# EAGLE design PCB_Punto_de_CobroV2 (EAGLE 8.7.0)
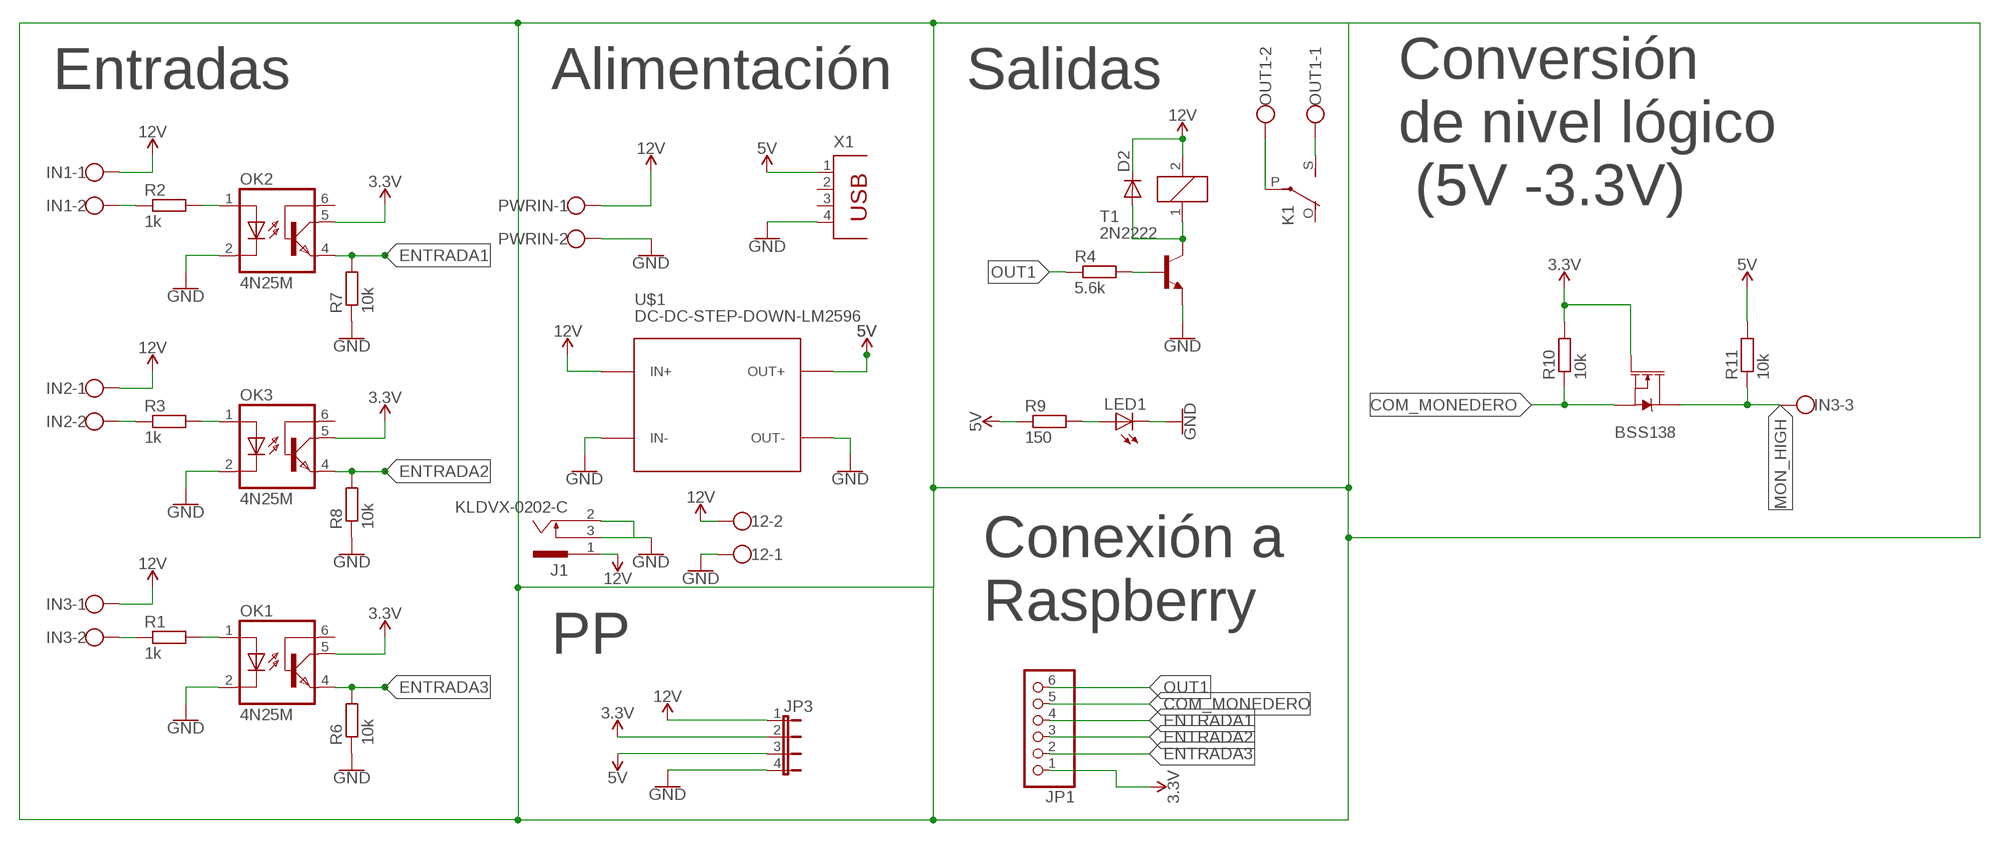
[diagram p0: schematic, sheet 1]

## Parts
12  W237-102  [W237-102]
D2  1N4148DO35-7  [DO35-7]
IN1  W237-102  [W237-102]
IN2  W237-102  [W237-102]
IN3  W237-103  [W237-103]
J1  KLDVX-0202-C  [KLDVX-0202-C]
JP1  PINHD-1X6  [1X06]
JP3  JP4E  [JP4]
K1  G5L  [G5LE]
LED1  LED5MM  [LED5MM]
OK1  4N25M  [DIL06]
OK2  4N25M  [DIL06]
OK3  4N25M  [DIL06]
OUT1  W237-102  [W237-102]
PWRIN  W237-102  [W237-102]
Q3  BSS138  MOSFET-NCH-BSS138  [SOT23-3]
R1  1k  R0204/7  [0204/7]
R2  1k  R0204/7  [0204/7]
R3  1k  R0204/7  [0204/7]
R4  5.6k  R0204/7  [0204/7]
R6  10k  R0204/7  [0204/7]
R7  10k  R0204/7  [0204/7]
R8  10k  R0204/7  [0204/7]
R9  150  R0204/7  [0204/7]
R10  10k  R0204/7  [0204/7]
R11  10k  R0204/7  [0204/7]
T1  2N2222  [TO18]
U$1  DC-DC-STEP-DOWN-LM2596  [DC-DC-STEP-DOWN-LM2596]
X1  PN87520  [PN87520]

## Nets
3.3V: JP1.1 JP3.2 OK1.5(COL) OK2.5(COL) OK3.5(COL) Q3.1(G) R10.2
5V: JP3.3 R9.1 R11.2 U$1.OUT+ X1.1
12V: 12.2 D2.C IN1.1 IN2.1 IN3.1 J1.1 JP3.1 K1.2 PWRIN.1 U$1.IN+
COM_MONEDERO: JP1.5 Q3.2(S) R10.1
ENTRADA1: JP1.4 OK2.4(EMI) R7.2
ENTRADA2: JP1.3 OK3.4(EMI) R8.2
ENTRADA3: JP1.2 OK1.4(EMI) R6.2
GND: 12.1 J1.2 J1.3 JP3.4 LED1.K(C) OK1.2(C) OK2.2(C) OK3.2(C) PWRIN.2 R6.1 R7.1 R8.1 T1.1(E) U$1.IN- U$1.OUT- X1.4
MON_HIGH: IN3.3 Q3.3(D) R11.1
N$1: OK1.1(A) R1.2
N$2: IN2.2 R3.1
N$3: OK2.1(A) R2.2
N$4: IN1.2 R2.1
N$5: OK3.1(A) R3.2
N$6: IN3.2 R1.1
N$9: R4.2 T1.2(B)
N$10: D2.A K1.1 T1.3(C)
N$11: LED1.A R9.2
N$12: K1.P(2:P) OUT1.2
N$13: K1.S(2:S) OUT1.1
OUT1: JP1.6 R4.1
Unconnected: J1.1@1 J1.2@1 J1.3@1 K1.O(2:O) OK1.6(BAS) OK2.6(BAS) OK3.6(BAS) X1.2 X1.3

## Notes on the sheet
- Entradas | Alimentación | Salidas
- Conversión 
  de nivel lógico
   (5V -3.3V)
- Conexión a 
  Raspberry
- PP

## Library data of the parts
12 IN1 IN2 OUT1 PWRIN = con-wago-500:W237-102: WAGO SCREW CLAMP; MPN: 237-102; OC_FARNELL: unknown; OC_NEWARK: 70K9898
D2 = diode:1N4148: DIODE high speed (Philips)
IN3 = con-wago-500:W237-103: WAGO SCREW CLAMP; MPN: 237-103; OC_FARNELL: unknown; OC_NEWARK: 18M7116
J1 = con-kycon:KLDVX-0202-: Power Jack, Vertical, PCB Mount, 2.0 mm, 2.5 mm, 3.0 mm Center Pin Source: KLDVX-0202x.pdf; OC_FARNELL: unknown; OC_NEWARK: unknown
JP1 = pinhead:PINHD-1X6: PIN HEADER
JP3 = jumper:JP4E: JUMPER
K1 = relay:G5L: RELAY 1 x switch, 10 A/120 V AC, 8 A/30 V ADC, Omron; OC_FARNELL: unknown; OC_NEWARK: unknown
LED1 = led:LED: LED OSRAM: - CHIPLED LG R971, LG N971, LY N971, LG Q971, LY Q971, LO R971, LY R971 LH N974, LH R974 LS Q976, LO Q976, LY Q976 LO Q996 - Hyper CHIPLED LW Q18S LB Q993, LB Q99A, LB R99A - SideLED LS A670, LO A670, LY A670, LG A670, LP A670 LB A673, LV A673, LT A673, LW A673 LH A674 LY A675 LS A676, LA A676, LO A676, LY A676, LW A676 LS A679, LY A679, LG A679 - Hyper Micro SIDELED® LS Y876, LA Y876, LO Y876, LY Y876 LT Y87S - SmartLED LW L88C, LW L88S LB L89C, LB L89S, LG L890 LS L89K, LO L89K, LY L89K LS L896, LA L896, LO L896, LY L896 - TOPLED LS T670, LO T670, LY T670, LG T670, LP T670 LSG T670, LSP T670, LSY T670, LOP T670, LYG T670 LG T671, LOG T671, LSG T671 LB T673, LV T673, LT T673, LW T673 LH T674 LS T676, LA T676, LO T676, LY T676, LB T676, LH T676, LSB T676, LW T676 LB T67C, LV T67C, LT T67C, LS T67K, LO T67K, LY T67K, LW E67C LS E67B, LA E67B, LO E67B, LY E67B, LB E67C, LV E67C, LT E67C LW T67C LS T679, LY T679, LG T679 LS T770, LO T770, LY T770, LG T770, LP T770 LB T773, LV T773, LT T773, LW T773 LH T774 LS E675, LA E675, LY E675, LS T675 LS T776, LA T776, LO T776, LY T776, LB T776 LHGB T686 LT T68C, LB T68C - Hyper Mini TOPLED® LB M676 - Mini TOPLED Santana® LG M470 LS M47K, LO M47K, LY M47K Source: http://www.osram.convergy.de LUXEON: - LUMILED® LXK2-PW12-R00, LXK2-PW12-S00, LXK2-PW14-U00, LXK2-PW14-V00 LXK2-PM12-R00, LXK2-PM12-S00, LXK2-PM14-U00 LXK2-PE12-Q00, LXK2-PE12-R00, LXK2-PE12-S00, LXK2-PE14-T00, LXK2-PE14-U00 LXK2-PB12-K00, LXK2-PB12-L00, LXK2-PB12-M00, LXK2-PB14-N00, LXK2-PB14-P00, LXK2-PB14-Q00 LXK2-PR12-L00, LXK2-PR12-M00, LXK2-PR14-Q00, LXK2-PR14-R00 LXK2-PD12-Q00, LXK2-PD12-R00, LXK2-PD12-S00 LXK2-PH12-R00, LXK2-PH12-S00 LXK2-PL12-P00, LXK2-PL12-Q00, LXK2-PL12-R00 Source: www.luxeon.com KINGBRIGHT: KA-3528ASYC Source: www.kingbright.com
OK1-OK3 = optocoupler:4N*?M: General Purpose 6-Pin Phototransistor Optocouplers Source: http://www.fairchildsemi.com/ds/4N/4N35-M.pdf; MPN: 4N25-M; OC_FARNELL: 1021349; OC_NEWARK: 98K9084
Q3 = SparkFun-DiscreteSemi:MOSFET-NCH: N-channel MOSFETs Voltage controlled devices that allow control of high current outputs. SparkFun Products: SparkFun OpenScale <https://www.sparkfun.com/products/13261> SparkFun Digital Sandbox <https://www.sparkfun.com/products/12651> SparkFun Monster Moto Shield <https://www.sparkfun.com/products/10182> SparkFun MOSFET Power Controller <https://www.sparkfun.com/products/11214>; PROD_ID: TRANS-00830; VALUE: 220mA/50V/3.5Ω
R1-R4 R6-R11 = eagle-ltspice:R: RESISTOR, European symbol; SPICEMODEL: NONE; SPICEPREFIX: R
T1 = transistor:2N2222: NPN TRANSISTOR
U$1 = diy-modules:DC-DC-STEP-DOWN-LM2596: DC/DC Step-Down Regulator based on LM2596-ADJ chip LM2596 datasheet available here: http://www.ti.com/lit/ds/symlink/lm2596.pdf Click here to find device on ebay.com <http://www.ebay.com/sch/lm2596+power+regulator>
X1 = con-berg:PN87520: BERG USB connector; OC_FARNELL: unknown; OC_NEWARK: unknown

## Board
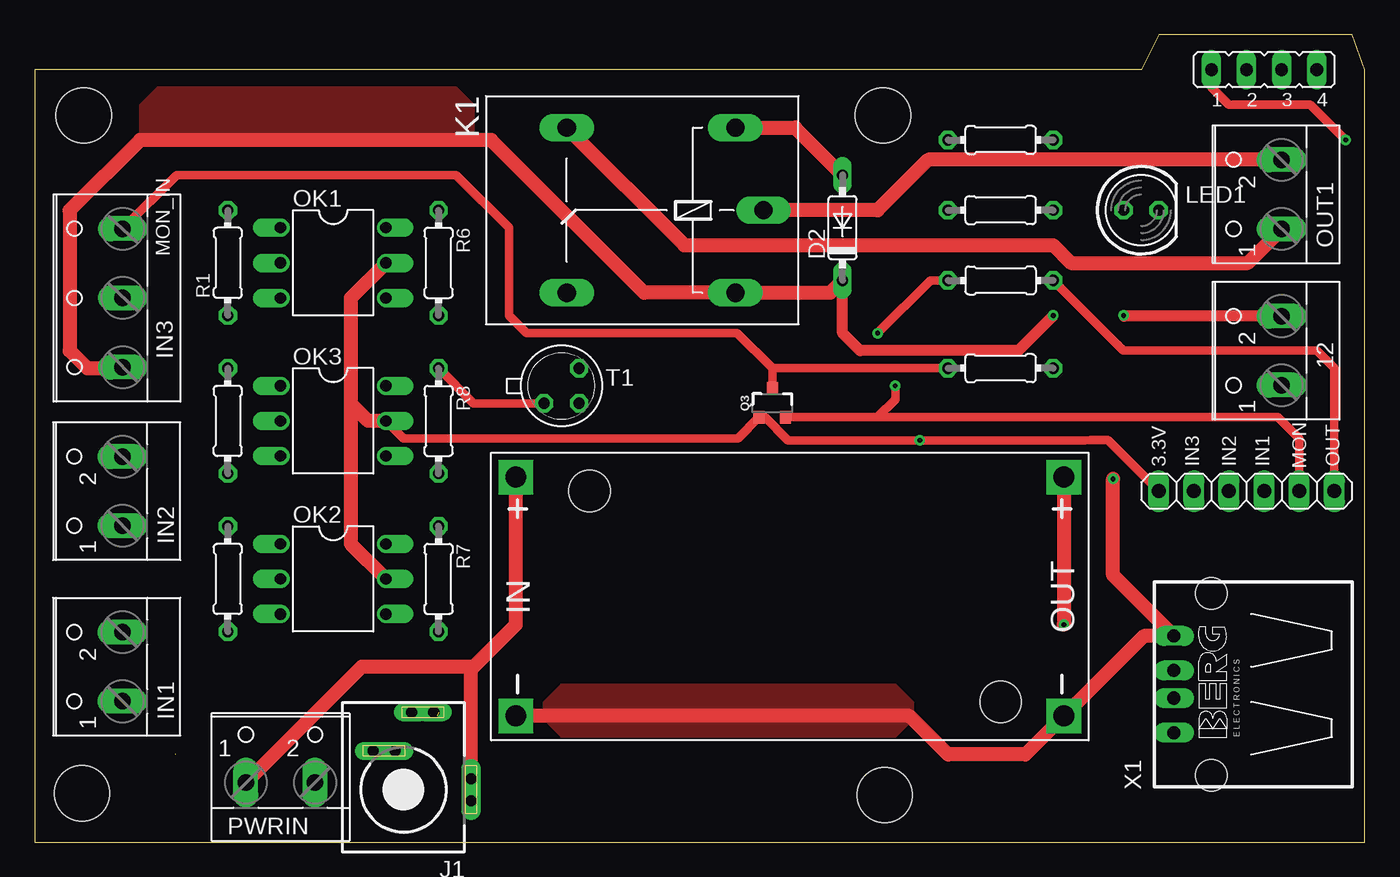
[diagram p1: board, top side]
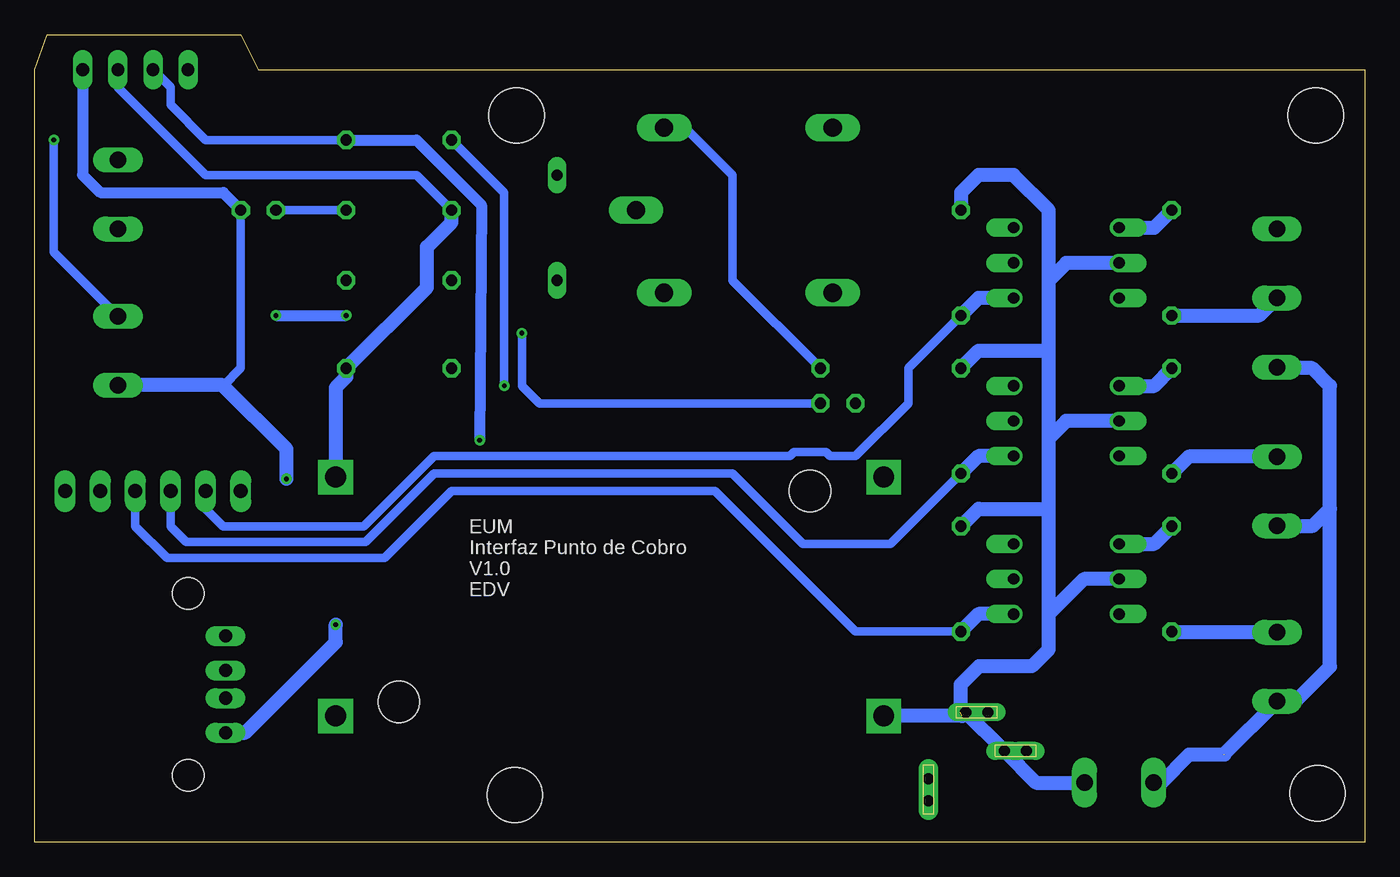
[diagram p2: board, bottom side, seen from below]

Size 96.19 x 58.42 mm. Coordinates in mm from the lower left corner, seen from the top.
Outline: 0,0 96.19,0 96.19,55.87 95.26,58.41 81.28,58.42 80.01,55.88 0,55.87 0,0
Copper layers (1*16): Top 0.035mm / dielectric 1.5mm / Bottom 0.035mm
Design rules "default": minimum track width 6mil, minimum drill 0.35mm, track to track 6mil, track to pad 6mil, pad to pad 6mil, via to via 6mil, smd to smd 6mil, copper to edge 40mil, drill to drill 6mil, minimum pad ring 10mil, minimum via ring 8mil, stop-mask expansion 4mil, vias tented up to drill 0mil, thermal gap 10mil
Holes 4 mm at 3.43,3.56 3.56,52.58 61.34,52.58 61.47,3.43

### Footprints (pad centres in the part's own frame; a part is rotated, then mirrored left to right if it is on the bottom)
W237-102 = drill 1.194 long: 1 -2.5,-1.27; 2 2.5,-1.27
DO35-7 = drill 0.813 long: A 3.81,0; C -3.81,0
W237-103 = drill 1.194 long: 1 -5,-1.29; 2 0,-1.29; 3 5,-1.29
KLDVX-0202-C = drill 0.8 pad 1.4 long: 1 -4.9,0.8; 1@1 -4.9,-0.8 | drill 0.8 pad 1.3 long: 2 -2.2,-5.6; 2@1 -0.6,-5.6; 3 0.6,-2.8; 3@1 2.2,-2.8
1X06 = drill 1.016 long: 1 -6.35,0; 2 -3.81,0; 3 -1.27,0; 4 1.27,0; 5 3.81,0; 6 6.35,0
JP4 = drill 0.914 long: 1 -3.81,0; 2 -1.27,0; 3 1.27,0; 4 3.81,0
G5LE = drill 1.321 long: 1 -7.493,-5.969; 2 -7.493,5.969; O 4.699,5.969; P -9.525,0; S 4.699,-5.969
LED5MM = drill 0.813 octagon: A -1.27,0; K 1.27,0
DIL06 = drill 0.813 offset: 1 -2.54,-3.81; 2 0,-3.81; 3 2.54,-3.81; 4 2.54,3.81; 5 0,3.81; 6 -2.54,3.81
SOT23-3 = smd 0.8 x 0.9: 1 -0.95,-1; 2 0.95,-1; 3 0,1.1
0204/7 = drill 0.813 octagon: 1 -3.81,0; 2 3.81,0
TO18 = drill 0.813 octagon: 1 -1.27,-1.27; 2 1.27,-1.27; 3 1.27,1.27
DC-DC-STEP-DOWN-LM2596 = drill 1.5 pad 2.5 square: IN+ -19.812,8.636; IN- -19.812,-8.636; OUT+ 19.812,8.636; OUT- 19.812,-8.636 | hole 3: -14.478,7.62; 15.24,-7.62
PN87520 = drill 0.95 long: 1 -3.5,2.71; 2 -1,2.71; 3 1,2.71; 4 3.5,2.71 | hole 2.3: -6.57,0; 6.57,0

### Placement (x,y rotation side)
12  88.9,35.56 90 top
D2  58.42,44.45 90 top
IN1  5.08,12.7 90 top
IN2  5.08,25.4 90 top
IN3  5.08,39.37 90 top
J1  26.67,3.81 180 top
JP1  87.63,25.4 0 top
JP3  88.9,55.88 0 top
K1  43.18,45.72 180 top
LED1  80.01,45.72 0 top
OK1  21.59,41.91 270 top
OK2  21.59,19.05 270 top
OK3  21.59,30.48 270 top
OUT1  88.9,46.86 90 top
PWRIN  17.78,5.59 0 top
Q3  53.34,31.75 0 top
R1  13.97,41.91 90 top
R2  13.97,19.05 90 top
R3  13.97,30.48 90 top
R4  69.85,40.64 180 top
R6  29.21,41.91 270 top
R7  29.21,19.05 270 top
R8  29.21,30.48 270 top
R9  69.85,45.72 0 top
R10  69.85,50.8 0 top
R11  69.85,34.29 0 top
T1  38.1,33.02 0 top
U$1  54.61,17.78 0 top
X1  85.09,11.43 90 top

### Tracks (layer width: path | path; a pad name or v marks a point on that pad's centre or on a via)
3.3V  (via drill 0.35)
  Top 0.61: OK3.5 26.67,29.21 50.85,29.21 Q3.1 52.79,30.75 54.46,29.08 v64.01,29.08 75.95,29.08 76.33,29.08 77.6,29.08 JP1.1
  Top 1.016: OK1.5 22.86,39.37 22.86,31.75 | 22.86,31.75 22.86,21.59 OK2.5 | OK3.5 24.13,30.48 22.86,31.75
  Bottom 0.61: JP3.2 86.36,54.61 86.36,53.34 83.82,50.8 R10.2
  Bottom 0.813: R10.2 68.58,50.8 63.88,46.1 v64.01,29.08
5V  (via drill 0.35)
  Top 1.016: U$1.OUT+ v74.42,15.75
  Bottom 0.61: R9.1 68.58,48.26 83.82,48.26 90.17,54.61 JP3.3
  Bottom 1.016: X1.1 80.97,7.93 74.42,14.48 v74.42,15.75 | U$1.OUT+ 74.42,32.89 73.66,33.66 R11.2 67.82,40.13 67.82,43.05 66.04,44.83 R9.1
12V  (via drill 0.35)  (1 unrouted)
  Top 0.61: v94.8,50.8 92.26,53.34 86.36,53.34 85.09,54.61 JP3.1
  Top 0.813: 12.2 78.78,38.06 v78.74,38.1 | v73.66,38.1 71.12,35.56 59.69,35.56 58.42,36.83 D2.C
  Top 1.016: U$1.IN+ 34.8,15.75 31.75,12.7 | D2.C 57.53,39.75 K1.2 44.07,39.75 33.02,50.8 7.62,50.8 2.54,45.72 2.54,35.56 3.81,34.29 6.29,34.29 IN3.1 | PWRIN.1 23.66,12.7 31.75,12.7 | J1.1 31.57,12.52 31.75,12.7
  Bottom 0.61: 12.2 94.8,42.69 v94.8,50.8
  Bottom 0.813: v78.74,38.1 v73.66,38.1
  Bottom 1.016: 2.54,24.13 2.54,12.7 5.04,10.2 IN1.1 10.2,6.35 | 2.54,24.13 2.54,33.02 3.81,34.29 6.35,34.29 6.37,34.31 IN3.1 | IN2.1 3.77,22.9 2.54,24.13 | 10.16,6.35 12.7,6.35 14.73,4.32 PWRIN.1
  pour Top: 7.62,50.8 7.62,53.34 8.89,54.61 30.48,54.61 31.75,53.34 31.75,50.8
COM_MONEDERO  (via drill 0.35)
  Top 0.61: Q3.2 60.96,30.75 | 60.96,30.75 89.9,30.75 91.44,29.21 JP1.5 | v62.23,33.02 62.23,32.02 60.96,30.75
  Bottom 0.61: R10.1 62.23,46.99 v62.23,33.02
ENTRADA1
  Bottom 0.61: JP1.4 88.9,22.86 86.61,20.57 70.87,20.57 66.04,25.4 46.99,25.4 36.83,15.24 R7.2
  Bottom 1.016: OK2.4 27.94,16.51 R7.2
ENTRADA2
  Bottom 0.61: JP1.3 86.36,22.86 85.24,21.74 72.24,21.74 67.31,26.67 45.72,26.67 40.64,21.59 34.29,21.59 R8.2
  Bottom 1.016: OK3.4 27.94,27.94 R8.2
ENTRADA3
  Bottom 0.61: R6.2 33.02,34.29 33.02,31.75 36.83,27.94 38.68,27.94 38.96,28.22 41.3,28.22 41.58,27.94 67.31,27.94 72.39,22.86 82.55,22.86 83.82,24.13 JP1.2
  Bottom 1.016: OK1.4 27.94,39.37 R6.2
GND  (via drill 0.35)  (1 unrouted)
  Top 0.61: T1.1 31.75,31.75 R8.1
  Top 1.016: U$1.IN- 63.25,9.14 66.04,6.35 71.63,6.35 U$1.OUT- 80.21,14.93 X1.4 77.98,19.33 v77.98,26.29
  Bottom 0.61: LED1.K 81.28,34.29 82.55,33.02
  Bottom 0.813: JP3.4 92.71,48.26 91.44,46.99 82.55,46.99 LED1.K
  Bottom 1.016: R6.1 29.21,46.99 27.94,48.26 25.4,48.26 22.86,45.72 22.86,40.64 | 22.86,16.51 22.86,13.97 24.09,12.74 27.9,12.74 29.24,11.4 29.24,9.41 | 22.86,16.51 22.86,24.13 | 22.86,24.13 22.86,29.21 | 22.86,29.21 22.86,35.56 | 22.86,35.56 22.86,40.64 | OK1.2 21.59,41.91 22.86,40.64 | OK3.2 21.59,30.48 22.86,29.21 | OK2.2 20.32,19.05 22.86,16.51 | R8.1 27.94,35.56 22.86,35.56 | R7.1 27.94,24.13 22.86,24.13 | v77.98,26.29 77.98,28.45 82.55,33.02 82.59,33.06 12.1 | U$1.IN- 29.14,9.14 J1.2 J1.3 23.78,4.32 PWRIN.2
  pour Top: 36.83,8.89 36.83,10.16 38.1,11.43 62.23,11.43 63.5,10.16 63.5,8.89 62.23,7.62 38.1,7.62
MON_HIGH
  Top 0.61: Q3.3 53.34,34.29 | 53.34,34.29 50.8,36.83 35.56,36.83 34.29,38.1 34.29,44.45 30.48,48.26 10.26,48.26 IN3.3 | R11.1 53.34,34.29
N$1
  Bottom 1.016: OK1.1 15.24,44.45 R1.2
N$2
  Bottom 1.016: IN2.2 12.74,27.9 R3.1
N$3
  Bottom 1.016: OK2.1 15.24,21.59 R2.2
N$4
  Bottom 1.016: IN1.2 13.93,15.2 R2.1
N$5
  Bottom 1.016: OK3.1 15.24,33.02 R3.2
N$6
  Bottom 1.016: R1.1 7.64,38.1 IN3.2
N$9  (via drill 0.35)
  Top 0.61: R4.2 64.77,40.64 v60.96,36.83
  Bottom 0.61: v60.96,36.83 60.96,33.02 59.69,31.75 T1.2
N$10
  Top 1.016: K1.1 54.99,51.69 D2.A
  Bottom 0.61: T1.3 45.72,40.64 45.72,48.26 49.15,51.69 K1.1
N$11
  Bottom 0.61: R9.2 LED1.A
N$12
  Top 1.016: OUT1.2 64.6,49.36 60.96,45.72 K1.P
N$13
  Top 1.016: K1.S 46.99,43.18 73.66,43.18 74.93,41.91 87.72,41.91 OUT1.1
OUT1
  Top 0.61: JP1.6 93.98,34.29 92.71,35.56 78.74,35.56 R4.1

### Text on the board
tPlace: MON_IN | 3.3V | IN3 | IN2 | IN1 | MON | OUT
bPlace: EUM / Interfaz Punto de Cobro / V1.0 / EDV